# Altium schematic sheet MAX98357.SchDoc: MAX98357 I2S MODULE
size A4; DocumentNumber: 1; SheetNumber: 1; SheetTotal: 1
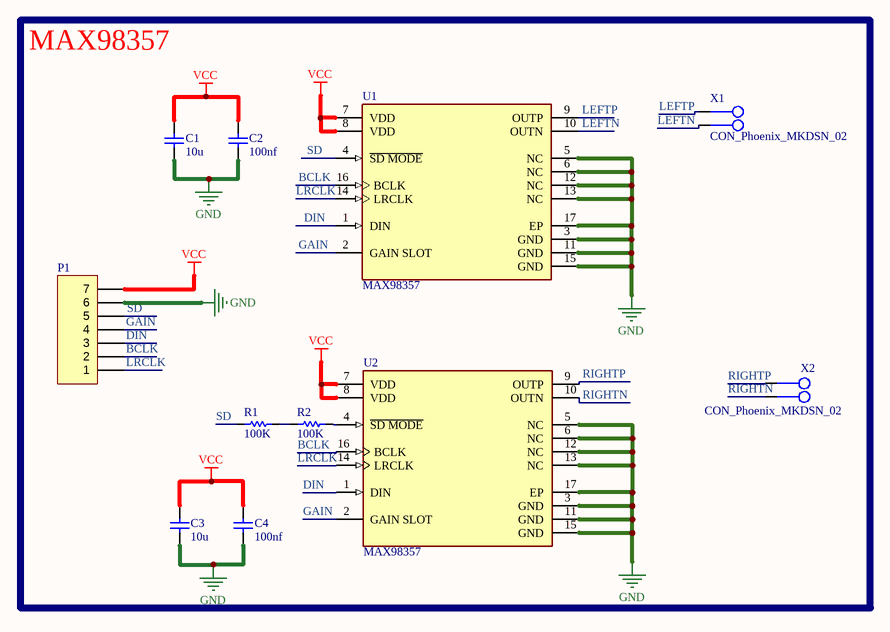
[diagram p0: MAX98357.SchDoc]

## Parts
C1  10u  [CAP 0805]
C2  100nf  [CAP 0805]
C3  10u  [CAP 0805]
C4  100nf  [CAP 0805]
P1  Header 7  [HDR1X7]  (value not drawn)
R1  100K  [RES 1206 (3216X08L)]
R2  100K  [RES 1206 (3216X08L)]
U1  MAX98357  [FP-T1633-4-IPC_A]
U2  MAX98357  [FP-T1633-4-IPC_A]
X1  CON_Phoenix_MKDSN_02  [CON_MKDSN1,5/2-5,08]
X2  CON_Phoenix_MKDSN_02  [CON_MKDSN1,5/2-5,08]

## Nets
GND: C1.2(-) C2.2(-) C3.2(-) C4.2(-) P1.6 U1.3(GND) U1.5(NC) U1.6(NC) U1.11(GND) U1.12(NC) U1.13(NC) U1.15(GND) U1.17(EP) U2.3(GND) U2.5(NC) U2.6(NC) U2.11(GND) U2.12(NC) U2.13(NC) U2.15(GND) U2.17(EP)
VCC: C1.1(+) C2.1(+) C3.1(+) C4.1(+) P1.7 U1.7(VDD) U1.8(VDD) U2.7(VDD) U2.8(VDD)
BCLK: P1.2 U1.16(BCLK) U2.16(BCLK)
DIN: P1.3 U1.1(DIN) U2.1(DIN)
GAIN: P1.4 U1.2(GAIN_SLOT) U2.2(GAIN_SLOT)
LEFTN: U1.10(OUTN) X1.2
LEFTP: U1.9(OUTP) X1.1
LRCLK: P1.1 U1.14(LRCLK) U2.14(LRCLK)
RIGHTN: U2.10(OUTN) X2.2
RIGHTP: U2.9(OUTP) X2.1
SD: P1.5 R1.1 U1.4(~{SD_MODE})
NetR1_2: R1.2 R2.1
NetR2_2: R2.2 U2.4(~{SD_MODE})

## Notes on the sheet
- MAX98357
- THIS DOCUMENT AND THE DATA DISCLOSED HEREIN OR
- HEREWITH IS THE PROPERTY OF ALTIUM LIMITED AND MAY
- DWG NO:
- REVISION
- REV:
- DESCRIPTION
- DATE
- APPROVED
- BE FREELY DISTRIBUTED IN WHOLE. NO RIGHTS ARE
- RESERVED OR EXPRESS OR IMPLIED WARANTEE GIVEN.
- ENG:
- APPROVALS
- PROJECT
- DSN:
- CHK:
- REFERENCE DOCUMENTS
- PROJECT REVISION:
- TITLE
- DOCUMENT REVISION:
- DESIGN ITEM:
- BOM:
- FAB DWG:
- PCB DWG:
- ASSY DWG:
- SCALE:
- A3
- SIZE
- CAGE CODE
- FILE NAME
- DWG NO.
- SHEET
- OF
- REV

## Library data of the parts
C1-C4 = Capacitor
P1 = Header 7: Header, 7-Pin; LatestRevisionDate: 17-Jul-2002; LatestRevisionNote: Re-released for DXP Platform.; Publisher: Altium Limited
R1 R2 = Resistor: Tolerance: 5%; Power: 1/4 W; Value: 100K
U1 U2 = CMP-05698-000018-1: IC AMP CLASS D MONO 3.2W 16TQFN; Max Supply Voltage: 5.5V; Max Output Current: 1.6A; Voltage Gain: 15dB; Max Power Dissipation: 1.666W; Min Supply Voltage: 2.5V; Power Supply Rejection Ratio (PSRR): 77dB; Series: -; Contact Plating: Tin; Min Operating Temperature: -40°C; Packaging: Tape and Reel; Max Output Power: 3.2W; Mount: Surface Mount; Number of Pins: 16; RoHS Compliant: Yes; Max Operating Temperature: 85°C; Radiation Hardening: No
X1 X2 = CON_Phoenix_MKDSN_02: Manufacturer: PHOENIX CONTACT; Company: SJ Libraries; Connector type: PCB Terminal Block; designer: Eng. Saeid Jorablo; Max Current: 13.5 A; Positions: 2; Revision 1: 2012/10/1 : Adding Model; Voltage: 400 V; Category: Connector; ComponentLink1Description: Datasheet; ComponentLink2Description: Reference; HelpURL: http://s3.picofile.com/file/7443264187/Coming_Soon_logo.gif; Mounting Technology: Through-Hole; Pin Count: 2; Publisher: SJ UnLimited; Status: Unreleased; Update: 2012/10/1